# Altium schematic sheet Schematic.SchDoc
size A3; CompanyName: Microchip Technology Inc.; Organization: Microchip Technology; Address1: 2355 West Chandler Blvd.; Address2: Chandler, AZ  85224; Address4: USA; DocumentNumber: 1; SheetNumber: 1; SheetTotal: 1; SheetTitle: PIC32CX1012BZ25048 Reference Design; ProjectDrawnBy: WSG; ProjectEngineer: WSG; ProjectPartNumber: -; ProjectTitle: PIC32CX1012BZ25048 Reference Design; ProjectBoardNumber: **; Time: Time
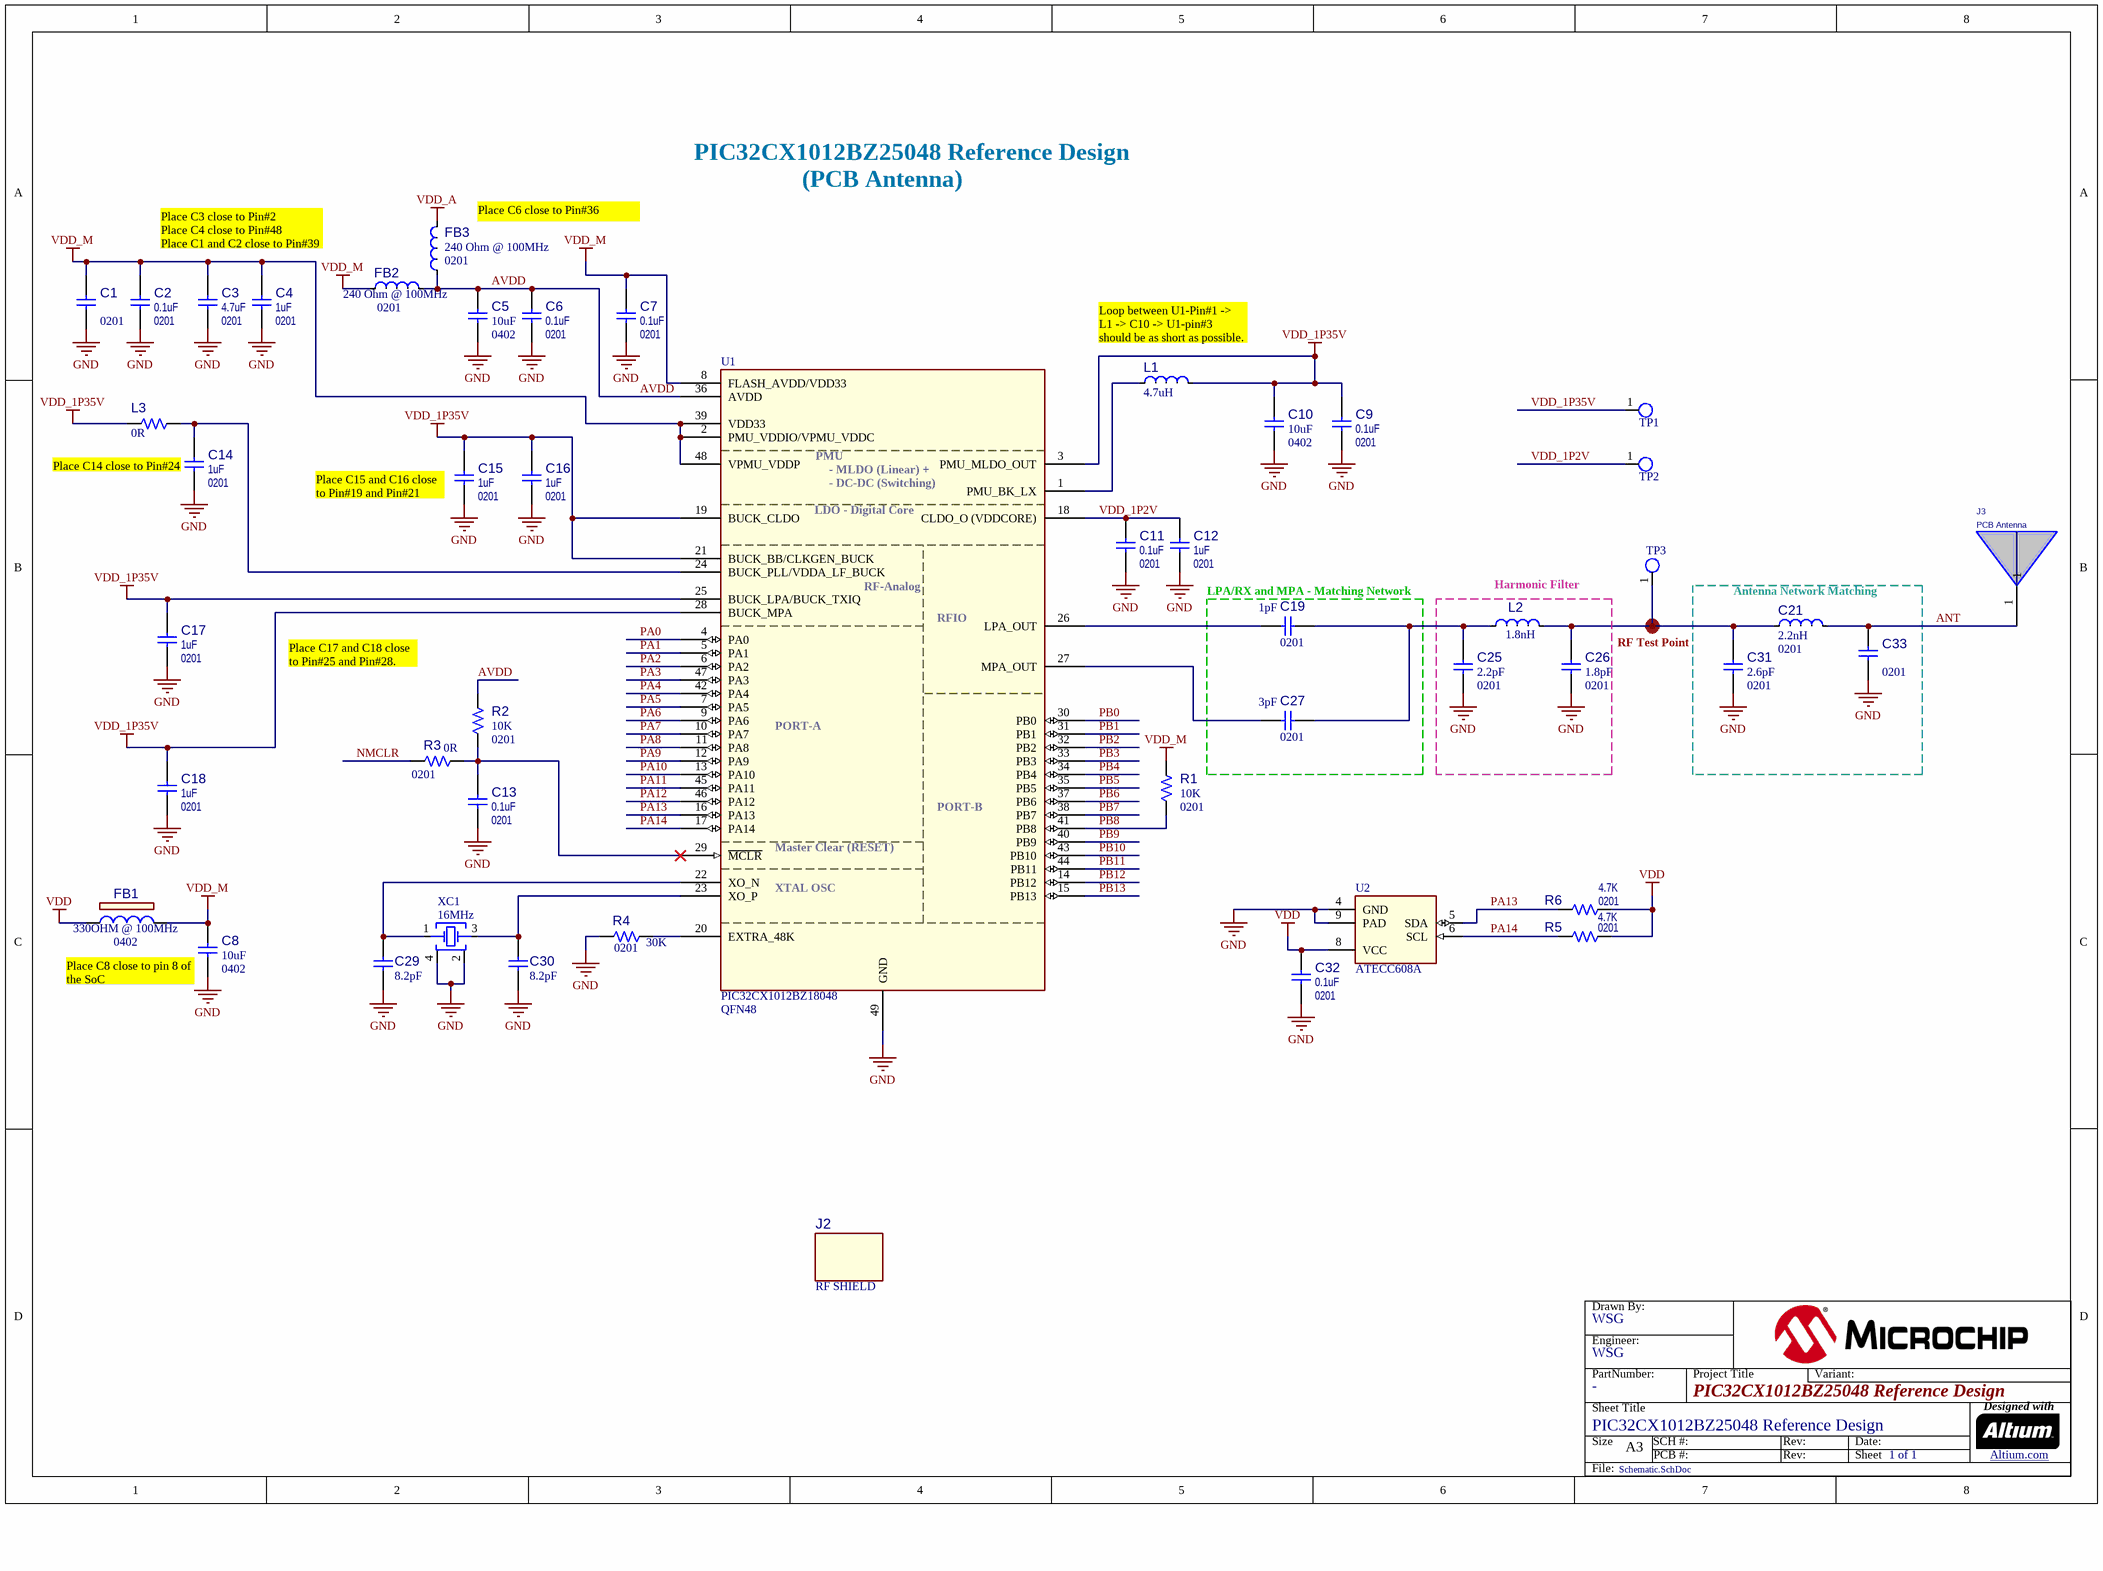
[diagram p0: Schematic.SchDoc]

## Parts
?  (no value)  (graphical)
C1  Package: 0201  [CAP_C_0201]  (hidden comment: Capacitor NP)
C2  value 0.1uF  Package: 0201  [CAP_C_0201]  (hidden comment: CAP1203_0.1uF)
C3  value 4.7uF  Package: 0201  [CAP_C_0201]  (hidden comment: CAP1203_4.7uF)
C4  value 1uF  Package: 0201  [CAP_C_0201]  (hidden comment: CAP1203_1uF_2)
C5  value 10uF  Package: 0402  [CAP_C_0402]  (hidden comment: CAP1766)
C6  value 0.1uF  Package: 0201  [CAP_C_0201]  (hidden comment: CAP1203_0.1uF)
C7  value 0.1uF  Package: 0201  [CAP_C_0201]  (hidden comment: CAP1203_0.1uF)
C8  value 10uF  Package: 0402  [CAP_C_0402]  (hidden comment: CAP1766)
C9  value 0.1uF  Package: 0201  [CAP_C_0201]  (hidden comment: CAP1203_0.1uF)
C10  value 10uF  Package: 0402  [CAP_C_0402]  (hidden comment: CAP1766)
C11  value 0.1uF  Package: 0201  [CAP_C_0201]  (hidden comment: CAP1203_0.1uF)
C12  value 1uF  Package: 0201  [CAP_C_0201]  (hidden comment: CAP1203_1uF_1)
C13  value 0.1uF  Package: 0201  [CAP_C_0201]  (hidden comment: CAP1203_0.1uF)
C14  value 1uF  Package: 0201  [CAP_C_0201]  (hidden comment: CAP1203_1uF_1)
C15  value 1uF  Package: 0201  [CAP_C_0201]  (hidden comment: CAP1203_1uF_1)
C16  value 1uF  Package: 0201  [CAP_C_0201]  (hidden comment: CAP1203_1uF_1)
C17  value 1uF  Package: 0201  [CAP_C_0201]  (hidden comment: CAP1203_1uF_1)
C18  value 1uF  Package: 0201  [CAP_C_0201]  (hidden comment: CAP1203_1uF_1)
C19  value 1pF  Package: 0201  [CAP_C_0201]  (hidden comment: Capacitor NP)
C21  value 2.2nH  Package: 0201  [CAP_C_0201]  (hidden comment: IND_2.2nH)
C25  value 2.2pF  Package: 0201  [CAP_C_0201]  (hidden comment: Capacitor NP)
C26  value 1.8pF  Package: 0201  [CAP_C_0201]  (hidden comment: Capacitor NP)
C27  value 3pF  Package: 0201  [CAP_C_0201]  (hidden comment: Capacitor NP)
C29  value 8.2pF  [CAP_C_0201]  (hidden comment: Capacitor NP)
C30  value 8.2pF  [CAP_C_0201]  (hidden comment: Capacitor NP)
C31  value 2.6pF  Package: 0201  [CAP_C_0201]  (hidden comment: Capacitor NP)
C32  value 0.1uF  Package: 0201  [CAP_C_0201]  (hidden comment: CAP1203_0.1uF)
C33  Package: 0201  [CAP_C_0201]  (hidden comment: Capacitor NP)
FB1  value 330OHM @ 100MHz  Package: 0402  [IND_C_0402]  (hidden comment: Ferrite Bead)
FB2  value 240 Ohm @ 100MHz  Package: 0201  [IND_C_0201]  (hidden comment: Ferrite Bead)
FB3  value 240 Ohm @ 100MHz  Package: 0201  [IND_C_0201]  (hidden comment: Ferrite Bead)
J2  value RF SHIELD  [RF_SHIELD]  (hidden comment: SHIELD)
J3  Antenna  [MONOPOLE_2LAYERS - duplicate]  (value not drawn)  (no BOM)
L1  value 4.7uH  [IND_C_0805]  (hidden comment: Inductor)
L2  value 1.8nH  [IND_C_0201]  (hidden comment: Inductor)
L3  value 0R  [IND_C_0402]  (hidden comment: IND1682)
R1  value 10K  Package: 0201  [RES_C_0201]  (hidden comment: Resistor)
R2  value 10K  Package: 0201  [RES_C_0201]  (hidden comment: Resistor)
R3  value 0R  Package: 0201  [RES_C_0201]  (hidden comment: Resistor)
R4  value 30K  Package: 0201  [RES_C_0201]  (hidden comment: Resistor)
R5  value 4.7K  Package: 0201  [RES_C_0201]  (hidden comment: Resistor)
R6  value 4.7K  Package: 0201  [RES_C_0201]  (hidden comment: Resistor)
TP1  TP  [TP\0P8]  (value not drawn)  (no BOM)
TP2  TP  [TP\0P8]  (value not drawn)  (no BOM)
TP3  RF_TP  [RF-TP\P_D1.2\S_W1.0_R1.7_2/3]  (value not drawn)  (no BOM)
U1  value PIC32CX1012BZ18048  Package: QFN48  [QFN-48_7X7]  (hidden comment: PIC32CX1012BZ25048)
U2  value ATECC608A  [UDFN-8_2X3_EP1.5X1.3]  (hidden comment: MIC8652)
XC1  value 16MHz  [AP7-00104]  (hidden comment: Crystal_2mm_1.6mm)

## Blocks framed on the sheet
LPA/RX and MPA - Matching Network: C19 C27
Harmonic Filter: C25 C26 L2
Antenna Network Matching: C21 C31 C33

## Nets
GND: C1.1 C2.1 C3.1 C4.1 C5.1 C6.1 C7.1 C8.1 C9.1 C10.1 C11.1 C12.1 C13.1 C14.1 C15.1 C16.1 C17.1 C18.1 C25.1 C26.1 C29.1 C30.1 C31.1 C32.1 C33.2 R4.1 U1.49(GND) U2.4(GND) U2.9(PAD) XC1.2 XC1.4
VDD: C32.2 FB1.1 R5.2 R6.2 U2.8(VCC)
VDD_1P35V: C9.2 C10.2 C15.2 C16.2 C17.2 C18.2 L1.2(F) L3.1 TP1.1(TP) U1.3(PMU_MLDO_OUT) U1.19(BUCK_CLDO) U1.21(BUCK_BB/CLKGEN_BUCK) U1.25(BUCK_LPA/BUCK_TXIQ) U1.28(BUCK_MPA)
VDD_A: FB3.2(F)
VDD_M: C1.2 C2.2 C3.2 C4.2 C7.2 C8.2 FB1.2 FB2.1(S) R1.2 U1.2(PMU_VDDIO/VPMU_VDDC) U1.8(FLASH_AVDD/VDD33) U1.39(VDD33) U1.48(VPMU_VDDP)
ANT: C21.1 C33.1 J3.1
AVDD: C5.2 C6.2 FB2.2(F) FB3.1(S) R2.2 U1.36(AVDD)
NMCLR: R3.1
PA0: U1.4(PA0)
PA1: U1.5(PA1)
PA2: U1.6(PA2)
PA3: U1.47(PA3)
PA4: U1.42(PA4)
PA5: U1.7(PA5)
PA6: U1.9(PA6)
PA7: U1.10(PA7)
PA8: U1.11(PA8)
PA9: U1.12(PA9)
PA10: U1.13(PA10)
PA11: U1.45(PA11)
PA12: U1.46(PA12)
PA13: R6.1 U1.16(PA13) U2.5(SDA)
PA14: R5.1 U1.17(PA14) U2.6(SCL)
PB0: U1.30(PB0)
PB1: U1.31(PB1)
PB2: U1.32(PB2)
PB3: U1.33(PB3)
PB4: U1.34(PB4)
PB5: U1.35(PB5)
PB6: U1.37(PB6)
PB7: U1.38(PB7)
PB8: R1.1 U1.41(PB8)
PB9: U1.40(PB9)
PB10: U1.43(PB10)
PB11: U1.44(PB11)
PB12: U1.14(PB12)
PB13: U1.15(PB13)
VDD_1P2V: C11.2 C12.2 TP2.1(TP) U1.18(CLDO_O_(VDDCORE))
NetC13_2: C13.2 R2.1 R3.2 U1.29(~{MCLR})
NetC14_2: C14.2 L3.2 U1.24(BUCK_PLL/VDDA_LF_BUCK)
NetC19_1: C19.1 C25.2 C27.1 L2.1(S)
NetC19_2: C19.2 U1.26(LPA_OUT)
NetC21_2: C21.2 C26.2 C31.2 L2.2(F) TP3.1(TP)
NetC27_2: C27.2 U1.27(MPA_OUT)
NetC29_2: C29.2 U1.22(XO_N) XC1.1
NetC30_2: C30.2 U1.23(XO_P) XC1.3
NetL1_1: L1.1(S) U1.1(PMU_BK_LX)
NetR4_2: R4.2 U1.20(EXTRA_48K)

## Notes on the sheet
- PIC32CX1012BZ25048 Reference Design
- Place C3 close to Pin#2
  Place C4 close to Pin#48
  Place C1 and C2 close to Pin#39
- (near FB3) Place C6 close to Pin#36
- (PCB Antenna)
- (near L1) Loop between U1-Pin#1 -> L1 -> C10 -> U1-pin#3 should be as short as possible.
- (near C14) Place C14 close to Pin#24
- (near C15) Place C15 and C16 close to Pin#19 and Pin#21
- (near U1) LDO - Digital Core
- (near U1) PMU
- (near U1) - MLDO (Linear) +
- (near U1) - DC-DC (Switching)
- PCB Antenna
- (near U1) RF-Analog
- (near U1) RFIO
- RF Test Point
- Place C17 and C18 close to Pin#25 and Pin#28.
- (near U1) PORT-A
- (near U1) Master Clear (RESET)
- (near U1) PORT-B
- (near U1) XTAL OSC
- (near C8) Place C8 close to pin 8 of the SoC
- Drawn By:
- Engineer:
- PartNumber:
- Project Title
- Variant:
- Sheet Title
- Size
- A3
- SCH #:
- PCB #:
- Rev:
- Date:
- Sheet
- Designed with
- Altium.com <http://go.altium.com/MicrochipLandingPage_Evaluation.html>
- File:

## Library data of the parts
? = Title Block A3
C1 C33 = CAP1535_DNP: CAP CER 0201; ComponentLink5Description: Open Footprint 2; ComponentLink6Description: Open Footprint 3; ComponentLink7Description: Open Footprint 4; Note: *
C2 C6 C7 C9 C11 C13 C32 = CAP1203_0.1uF: CAP CER 0.1UF 16V X5R 0201; Manufacturer: Murata; Manufacturer Part Number: GRM033R61C104KE84D; Alternate Part Number: GRM033R61A104ME15D; Alternate Part Description: CAP CER 0.1UF 10V X5R 0201; ComponentLink5Description: Open Footprint 2; ComponentLink6Description: Open Footprint 3; ComponentLink7Description: Open Footprint 4; Note: *; Alternate Manufacturer: Murata
C3 = CAP1203_4.7uF: CAP CER 4.7UF 6.3V X5R 0201; Manufacturer: Murata; Manufacturer Part Number: GRM035R60J475ME15J; Alternate Part Number: CM03X5R475M06AH055; Alternate Manufacturer: KYOCERA AVX; ComponentLink5Description: Open Footprint 2; ComponentLink6Description: Open Footprint 3; ComponentLink7Description: Open Footprint 4; Note: *; Alternate Part Description: CAP CER 4.7UF 6.3V X5R 0201
C4 = CAP1203_1uF_2: CAP CER 1UF 10V X5R 0201; Manufacturer: Murata; Manufacturer Part Number: GRM033R61A105ME15; Alternate Part Number: CL03A105MQ3CSNH; Alternate Manufacturer: Samsung; Alternate Part Description: CAP CER 1UF 6.3V X5R 0201; ComponentLink5Description: Open Footprint 2; ComponentLink6Description: Open Footprint 3; ComponentLink7Description: Open Footprint 4; Note: *
C5 C8 C10 = CAP1766: CAP CER 10UF 6.3V X5R 0402; Manufacturer: Murata; Manufacturer Part Number: GRM155R61A106ME11#; Alternate Part Number: CC0402MRX5R6BB106; Alternate Manufacturer: Yageo; Alternate Part Description: CAP CER 10UF 10V X5R 0402; ComponentLink5Description: Open Footprint 2; ComponentLink6Description: Open Footprint 3; ComponentLink7Description: Open Footprint 4; Note: *
C12 C14-C18 = CAP1203_1uF_1: CAP CER 1UF 10V X5R 0201; Manufacturer: Murata; Manufacturer Part Number: GRM033R61A105ME15; Alternate Part Number: GRM033R60J105MEA2D; Alternate Part Description: CAP CER 1UF 6.3V X5R 0201; ComponentLink5Description: Open Footprint 2; ComponentLink6Description: Open Footprint 3; ComponentLink7Description: Open Footprint 4; Note: *; Alternate Manufacturer: Murata
C19 = CAP1535_1pF: CAP CER 1PF 25V C0G/NP0 0201; Manufacturer: Murata; Manufacturer Part Number: GJM0335C1E1R0BB01D; Alternate Part Number: 250R05L1R0BV4T; Alternate Manufacturer: Johanson; ComponentLink5Description: Open Footprint 2; ComponentLink6Description: Open Footprint 3; ComponentLink7Description: Open Footprint 4; Note: *; Alternate Part Description: CAP CER 1PF 25V C0G/NP0 0201
C21 = IND_2.2nH: FIXED IND 2.2NH 600MA 120MOHM SM; Manufacturer: Murata; Manufacturer Part Number: LQP03HQ2N2B02; Alternate Manufacturer: TDK; Alternate Part Number: ‎MHQ0603P2N2BT000‎; Alternate Part Description: FIXED IND 2.2NH 700MA 150MOHM SM; ComponentLink5Description: Open Footprint 2; ComponentLink6Description: Open Footprint 3; ComponentLink7Description: Open Footprint 4; Note: *
C25 = CAP1535_2.2pF: CAP CER 2.2PF 50V C0G/NP0 0201; Manufacturer: Murata; Manufacturer Part Number: GJM0335C1H2R2BB01; Alternate Part Number: 250R05L2R2BV4T; Alternate Manufacturer: Johanson; Alternate Part Description: CAP CER 2.2PF 25V C0G/NP0 0201; ComponentLink5Description: Open Footprint 2; ComponentLink6Description: Open Footprint 3; ComponentLink7Description: Open Footprint 4; Note: *
C26 = CAP1535_1.8pF: CAP CER 1.8PF 50V C0G/NP0 0201; Manufacturer: Murata; Manufacturer Part Number: GJM0335C1H1R8BB01; Alternate Part Number: 250R05L1R8BV4T; Alternate Manufacturer: Johanson; Alternate Part Description: CAP CER 1.8PF 25V C0G/NP0 0201; ComponentLink5Description: Open Footprint 2; ComponentLink6Description: Open Footprint 3; ComponentLink7Description: Open Footprint 4; Note: *
C27 = CAP1535_3pF: CAP CER 3PF 25V C0G/NP0 0201; Manufacturer: Murata; Manufacturer Part Number: GJM0335C1E3R0BB01D; Alternate Part Number: 250R05L3R0BV4T; Alternate Manufacturer: Johanson; ComponentLink5Description: Open Footprint 2; ComponentLink6Description: Open Footprint 3; ComponentLink7Description: Open Footprint 4; Note: *; Alternate Part Description: CAP CER 3PF 25V C0G/NP0 0201
C29 C30 = CAP1529: CAP CER 8.2PF 25V C0G/NP0 0201; Manufacturer: Murata; Manufacturer Part Number: GRM0335C1E8R2BA01D; Alternate Part Number: CC0201DRNPO8BN8R2‎; Alternate Manufacturer: Yageo; Alternate Part Description: CAP CER 8.2PF 25V C0G/NPO 0201; ComponentLink5Description: Open Footprint 2; ComponentLink6Description: Open Footprint 3; ComponentLink7Description: Open Footprint 4; Note: *
C31 = CAP1535_2.6pF: CAP CER 2.6PF 50V C0G/NP0 0201; Manufacturer: Murata; Manufacturer Part Number: GRM0335C1H2R6BA01D; Alternate Manufacturer: Samsung; Alternate Part Number: CL03C2R6BA3GNNC; Alternate Part Description: CAP CER 2.6PF 25V C0G/NP0 0201; ComponentLink5Description: Open Footprint 2; ComponentLink6Description: Open Footprint 3; ComponentLink7Description: Open Footprint 4; Note: *
FB1 = FB1005: FERRITE BEAD 330 OHM 1.2A 0402 1LN; Manufacturer: Murata; Manufacturer Part Number: BLM15PX331SN1D; Alternate Part Number: MPZ1005S331ET000; Alternate Manufacturer: TDK; Alternate Part Description: FERRITE BEAD 330 OHM 0402 1LN; ComponentLink5Description: Open Footprint 2; ComponentLink6Description: Open Footprint 3; ComponentLink7Description: Open Footprint 4; Note: *
FB2 FB3 = IND1249_FB: FERRITE BEAD 240 OHM 0201 1LN; Manufacturer Part Number: BLM03AX241SN1#; Manufacturer: Murata; Alternate Part Number: MMZ0603S241CT000; Alternate Manufacturer: TDK; ComponentLink5Description: Open Footprint 2; ComponentLink6Description: Open Footprint 3; ComponentLink7Description: Open Footprint 4; Note: *; Alternate Part Description: FERRITE BEAD 240 OHM 0201 1LN
J2 = SHIELD: RF SHIELD; Manufacturer: BI-LINK; Manufacturer Part Number: DWG-B32-022; Alternate Manufacturer: *; Alternate Part Number: *; Package: *
J3 = Antenna: PCB Antenna; HEIGHT: 0MM; Category: Connector; ROHS: YES
L1 = IND1176: FIXED IND 4.7UH 1.2A 275MOHM SMD 0805; Manufacturer: Murata; Manufacturer Part Number: LQM21PN4R7MGH; Alternate Manufacturer: Taiyo Yuden; Alternate Part Number: CB2012T4R7M; Alternate Part Description: FIXED IND 4.7UH 580MA 520MOHM SM; ComponentLink5Description: Open Footprint 2; ComponentLink6Description: Open Footprint 3; ComponentLink7Description: Open Footprint 4; Package: 0805; Note: *
L2 = IND1249_1.8nH: FIXED IND 1.8NH 800MA 80MOHM SMD; Manufacturer: Murata; Manufacturer Part Number: LQP03HQ1N8B02#; Alternate Part Number: MHQ0603P1N8BT000; Alternate Manufacturer: TDK; Alternate Part Description: FIXED IND 1.8NH 700MA 120MOHM SM; DCR: 0.12R; ComponentLink5Description: Open Footprint 2; ComponentLink6Description: Open Footprint 3; ComponentLink7Description: Open Footprint 4; Package: 0201
L3 = IND1682: RES 0 OHM JUMPER 1/16W 0402; Manufacturer: Yageo; Manufacturer Part Number: RC0402JR-070RL; Alternate Part Number: CRG0402ZR; Alternate Manufacturer: TE Connectivity; Alternate Part Description: RES SMD 0 OHM JUMPER 1/16W 0402; ComponentLink5Description: Open Footprint 2; ComponentLink6Description: Open Footprint 3; ComponentLink7Description: Open Footprint 4; Package: 0402
R1 R2 = RES1519_10K: RES SMD 10K OHM 1% 1/20W 0201; Manufacturer: Panasonic; Manufacturer Part Number: ERJ-1GEF1002C; ComponentLink5Description: Open Footprint 2; ComponentLink6Description: Open Footprint 3; ComponentLink7Description: Open Footprint 4; Alternate Part Description: *
R3 = RES2175_0R: RES SMD 0 OHM JUMPER 1/20W 0201; Manufacturer: Panasonic; Manufacturer Part Number: ERJ-1GN0R00C; ComponentLink5Description: Open Footprint 2; ComponentLink6Description: Open Footprint 3; ComponentLink7Description: Open Footprint 4
R4 = RES1519_30K: RES SMD 30K OHM 1% 1/20W 0201; Manufacturer: Panasonic; Manufacturer Part Number: ERJ-1GNF3002C; Alternate Part Number: RC0201FR-0730KL; Alternate Manufacturer: Yageo; Alternate Part Description: RES 30K OHM 1% 1/20W 0201; ComponentLink5Description: Open Footprint 2; ComponentLink6Description: Open Footprint 3; ComponentLink7Description: Open Footprint 4
R5 R6 = RES1519_4.7K: RES SMD 4.7K OHM 1% 1/20W 0201; Manufacturer: Panasonic; Manufacturer Part Number: ERJ-1GEF4701C; ComponentLink5Description: Open Footprint 2; ComponentLink6Description: Open Footprint 3; ComponentLink7Description: Open Footprint 4
TP1 TP2 = TP: TEST POINT
TP3 = RF_TP: RF TP
U1 = PIC32CX1012BZ25048: IC SIP 1M MCU BT5 ZigBee Radio QFN48; Manufacturer: Microchip Technology; Manufacturer Part Number: PIC32CX1012BZ25048
U2 = MIC8652: IC AUTHENTICATION CHIP 8UDFN; Manufacturer: Microchip Technology; Manufacturer Part Number: ATECC608A-MAHDA-S; ComponentLink1Description: SVN Datasheet; ComponentLink2Description: Local Datasheet; ComponentLink5Description: Open Footprint 2; ComponentLink6Description: Open Footprint 3; ComponentLink7Description: Open Footprint 4
XC1 = Crystal_2mm_1.6mm: CRYSTAL 16.0000MHZ 8PF SMD; Manufacturer: Tai-Saw Technology Co., LTD; Manufacturer Part Number: TZ2761D; Alternate Part Number: Q 16,0-JXS21-8-10/15-T1-WA-LF; Alternate Manufacturer: Jauch Quartz; Alternate Part Description: CRYSTAL 16.0000MHZ 8PF SMD